# Altium schematic sheet Schematic.SchDoc
size A
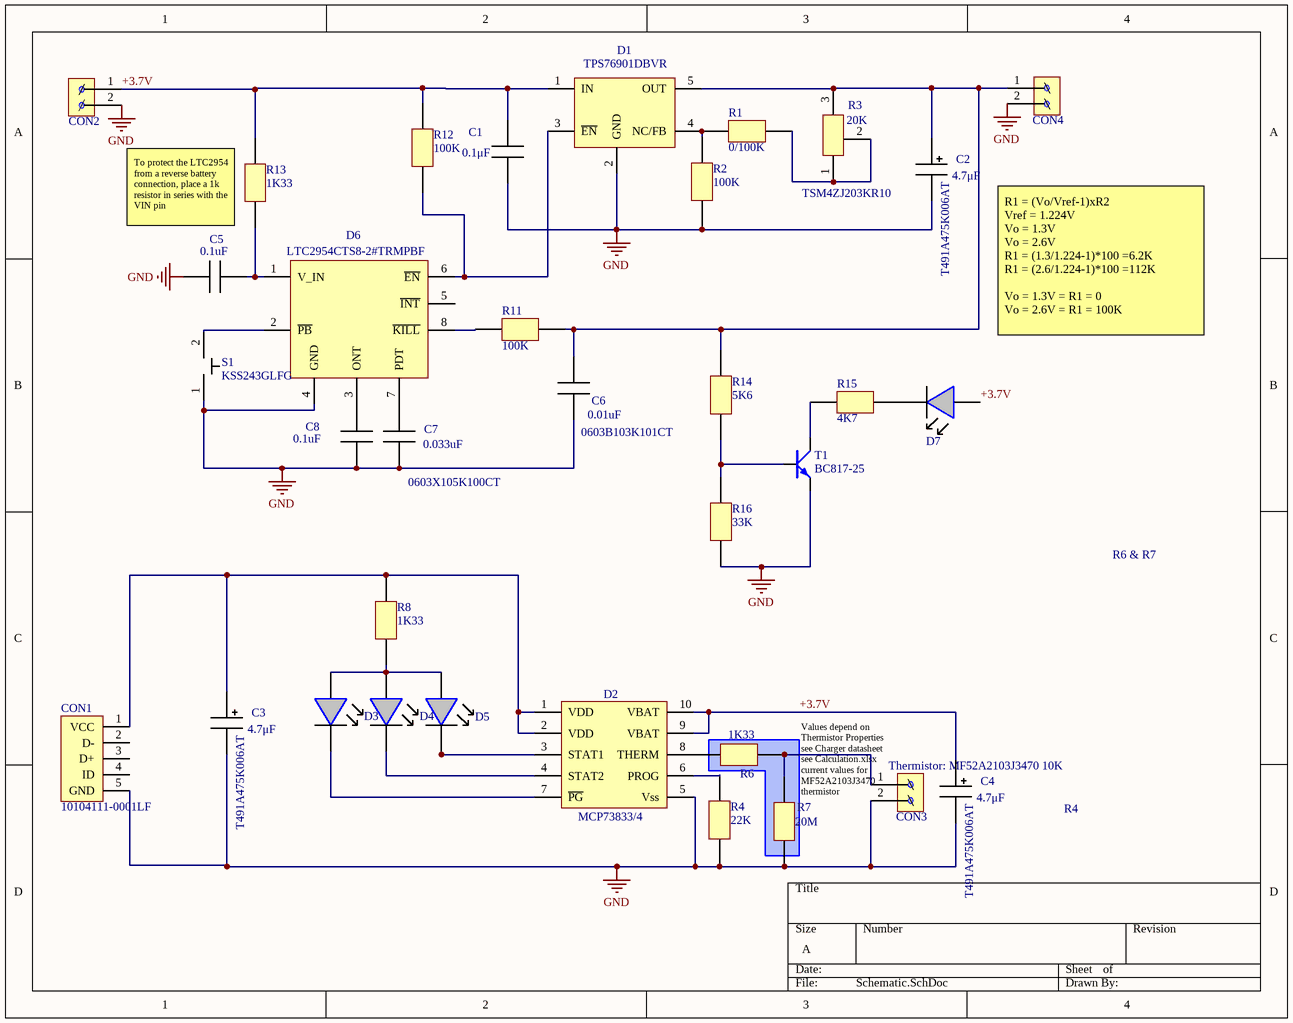
[diagram p0: Schematic.SchDoc]

## Parts
C1  Capasitance: 0.1μF  [CAPC1608X05N]  (hidden comment: Capasitor)
C2  Capasitance: 4.7μF  ManufacturerPN: T491A475K006AT  [CAPMP3216X18N]  (hidden comment: Capasitor_POL)
C3  Capasitance: 4.7μF  ManufacturerPN: T491A475K006AT  [CAPMP3216X18N]  (hidden comment: Capasitor_POL)
C4  Capasitance: 4.7μF  ManufacturerPN: T491A475K006AT  [CAPMP3216X18N]  (hidden comment: Capasitor_POL)
C5  Capasitance: 0.1uF  [CAPC1608X05N]  (hidden comment: Capasitor)
C6  Capasitance: 0.01uF  ManufacturerPN: 0603B103K101CT  [CAPC1608X05N]  (hidden comment: Capasitor)
C7  Capasitance: 0.033uF  ManufacturerPN: 0603X105K100CT  [CAPC1608X05N]  (hidden comment: Capasitor)
C8  Capasitance: 0.1uF  [CAPC1608X05N]  (hidden comment: Capasitor)
CON1  PartNumber: 10104111-0001LF  [MicroUSB]  (hidden comment: CON?)
CON2  CON?  [HDR1X2_no_body]  (value not drawn)
CON3  Thermistor: MF52A2103J3470 10K  [HDR1X2_no_body]  (hidden comment: CON?)
CON4  CON?  [HDR1X2_no_body]  (value not drawn)
D1  PartNumber: TPS76901DBVR  [SOT23-5AN]  (hidden comment: D?)
D2  MCP73833/4  [TSSOP50P490-10AN]
D3  LED  [CD1608-0603]  (value not drawn)
D4  LED  [CD1608-0603]  (value not drawn)
D5  LED  [CD1608-0603]  (value not drawn)
D6  TexasInstruments: LTC2954CTS8-2#TRMPBF  [TSOP65P280X100-8N]  (hidden comment: D?)
D7  LED  [CD1608-0603]  (value not drawn)
R1  Resistance: 0/100K  [RESC1608X04N]  (hidden comment: R?)
R2  Resistance: 100K  [RESC1608X04N]  (hidden comment: R?)
R3  Resistance: 20K  PartNumber: TSM4ZJ203KR10  [TSM4ZJ]  (hidden comment: R?)
R4  Resistance: 22K  [RESC1608X04N]  (hidden comment: R?)
R6  Resistance: 1K33  [RESC1608X04N]  (hidden comment: R?)
R7  Resistance: 20M  [RESC1608X04N]  (hidden comment: R?)
R8  Resistance: 1K33  [RESC1608X04N]  (hidden comment: R?)
R11  Resistance: 100K  [RESC1608X04N]  (hidden comment: R?)
R12  Resistance: 100K  [RESC1608X04N]  (hidden comment: R?)
R13  Resistance: 1K33  [RESC1608X04N]  (hidden comment: R?)
R14  Resistance: 5K6  [RESC1608X04N]  (hidden comment: R?)
R15  Resistance: 4K7  [RESC1608X04N]  (hidden comment: R?)
R16  Resistance: 33K  [RESC1608X04N]  (hidden comment: R?)
S1  ManufacturerPN: KSS243GLFG  [KSS241]  (hidden comment: S?)
T1  BC817-25  [SOT323-3AM]

## Nets
GND: C1.2 C2.2 C3.2 C4.2 C5.2 C6.2 C7.2 C8.2 CON1.5(GND) CON2.2 CON3.2 CON4.2 D1.2(GND) D2.5(Vss) D6.4(GND) R2.2 R4.2 R7.2 R16.2 S1.1 T1.2(E)
+3.7V: C1.1 C4.1 CON2.1 D1.1(IN) D2.9(VBAT) D2.10(VBAT) D7.1 R12.1 R13.1
NetC2_1: C2.1 C6.1 CON4.1 D1.5(OUT) R3.3 R11.2 R14.1
NetC3_1: C3.1 CON1.1(VCC) D2.1(VDD) D2.2(VDD) R8.1
NetC5_1: C5.1 D6.1(V_IN) R13.2
NetC7_1: C7.1 D6.7(PDT)
NetC8_1: C8.1 D6.3(ONT)
NetCON3_1: CON3.1 R6.2 R7.1
NetD1_3: D1.3(~{EN}) D6.6(~{EN}) R12.2
NetD1_4: D1.4(NC/FB) R1.1 R2.1
NetD2_3: D2.3(STAT1) D5.2
NetD2_4: D2.4(STAT2) D4.2
NetD2_6: D2.6(PROG) R4.1
NetD2_7: D2.7(~{PG}) D3.2
NetD2_8: D2.8(THERM) R6.1
NetD3_1: D3.1 D4.1 D5.1 R8.2
NetD6_2: D6.2(~{PB}) S1.2
NetD6_8: D6.8(~{KILL}) R11.1
NetD7_2: D7.2 R15.2
NetR1_2: R1.2 R3.1 R3.2
NetR14_2: R14.2 R16.1 T1.1(B)
NetR15_1: R15.1 T1.3(C)

Not connected (* = marked no-connect by the designer): CON1 2(D-) 3(D+) 4(ID); D6 5(~{INT})

## Notes on the sheet
- (near R13) To protect the LTC2954 from a reverse battery connection, place a 1k resistor in series with the VIN pin
- R1 = (Vo/Vref-1)xR2
  Vref = 1.224V
  Vo = 1.3V
  Vo = 2.6V
  R1 = (1.3/1.224-1)*100 =6.2K
  R1 = (2.6/1.224-1)*100 =112K
  Vo = 1.3V = R1 = 0
  Vo = 2.6V = R1 = 100K
- R6 & R7
- (near CON3) Values depend on Thermistor Properties
  see Charger datasheet
  see Calculation.xlsx
  current values for MF52A2103J3470 thermistor
- R4

## Library data of the parts
C2-C4 = Capasitor_POL: Manufacturer: KEMET; Farnell: 2321209
C6 C7 = Capasitor: Manufacturer: WALSIN
  C6: Farnell: 2496825
  C7: Farnell: 2496916
CON1 = MicroUSB: Manufacturer: AMPHENOL FCI; Farnell: 2293755
CON2-CON4 = HDR1X2
D1 = TPS76901: Farnell: 2112624
D6 = LTC2654-2: Farnell: 1663887
R1 R2 R4 R6-R8 R11-R16 = Resistor
R3 = Resistor_ADJ: Manufacturer: VISHAY; Farnell: 8792500
S1 = PushButton: Manufacturer: C and K components; Farnell: 2320069
T1 = NPN SMD